# Altium project Wildcat Racing.PrjPcb
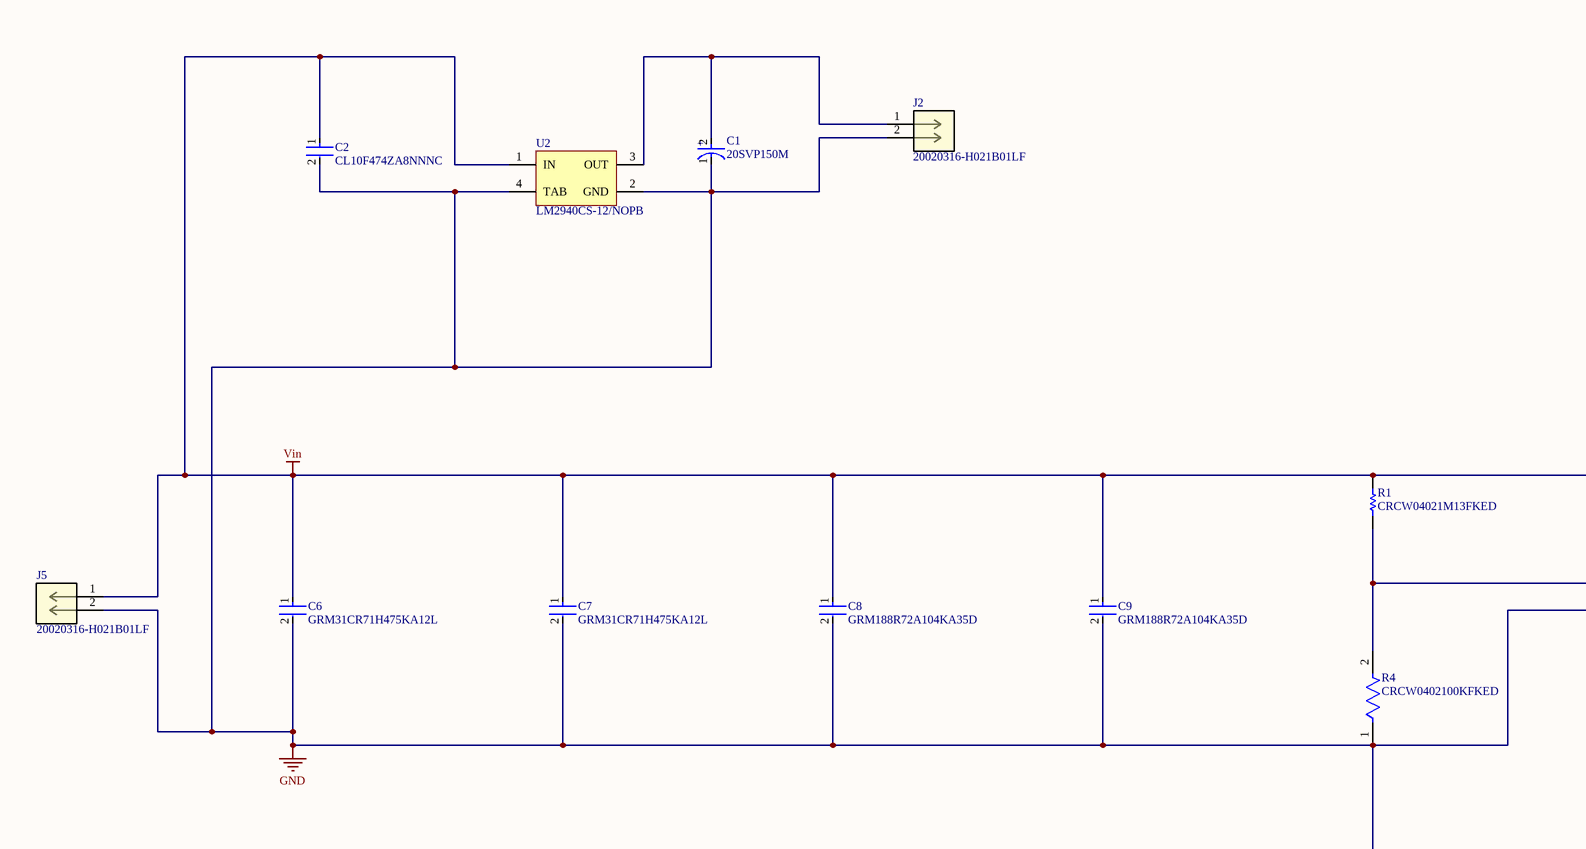
[diagram p0: 12V Power.SchDoc, left]
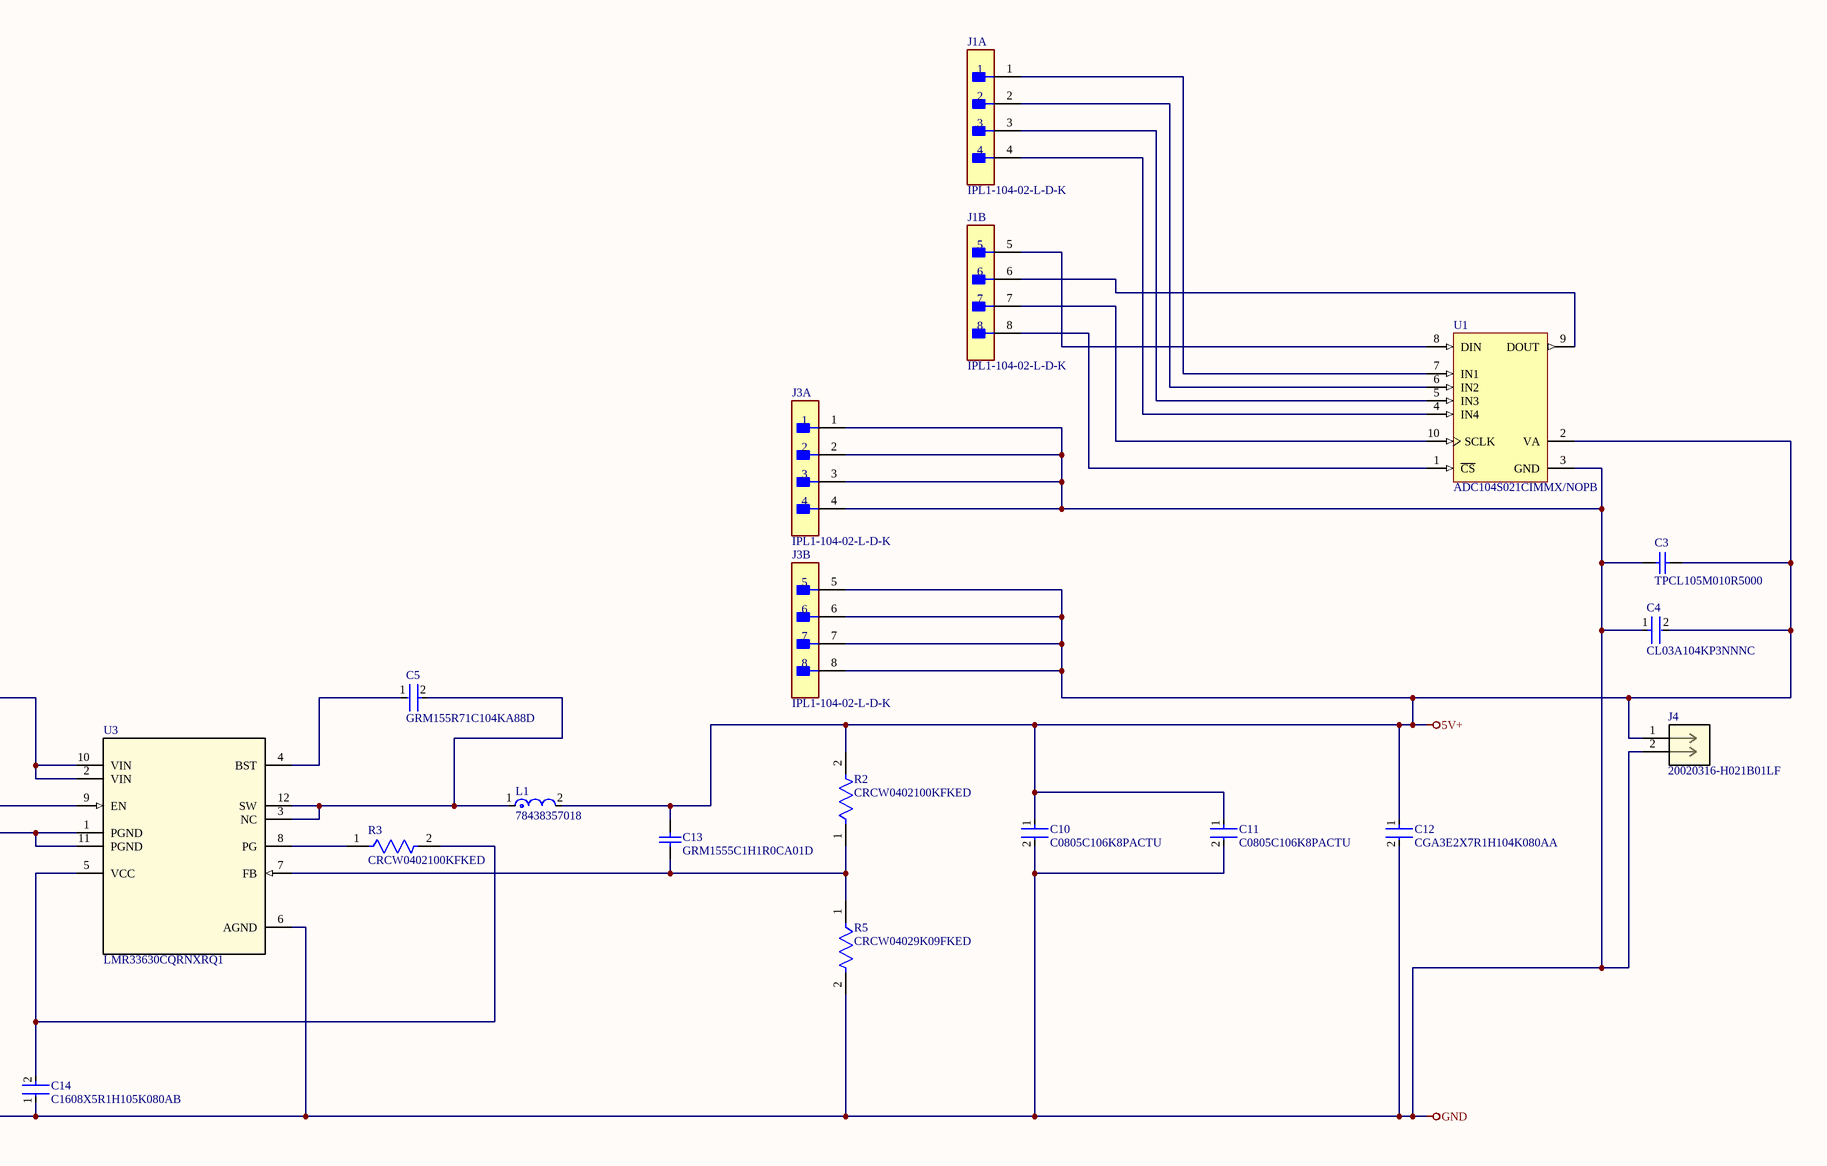
[diagram p1: 12V Power.SchDoc, right]
1 sheet, 28 parts. Net scope: global (net labels, ports and power ports of the same name join across sheets).
Board file: 12V Power.PcbDoc

## Sheet 12V Power.SchDoc
size D; SheetNumber: 1; SheetTotal: 1

### Parts
C1  20SVP150M  [FP-OS-CON-SMT-F12-MFG]
C2  CL10F474ZA8NNNC  [FP-CL10-IPC_C]
C3  TPCL105M010R5000  [CAPC1609X100X15LL20]
C4  CL03A104KP3NNNC  [FP-CL03-IPC_C]
C5  GRM155R71C104KA88D  [FP-GRM15-MFG]
C6  GRM31CR71H475KA12L  [FP-GRM31C-0_2-e0_3_0_8-IPC_C]
C7  GRM31CR71H475KA12L  [FP-GRM31C-0_2-e0_3_0_8-IPC_C]
C8  GRM188R72A104KA35D  [FP-GRM188-0_1-e0_2_0_5-IPC_B]
C9  GRM188R72A104KA35D  [FP-GRM188-0_1-e0_2_0_5-IPC_B]
C10  C0805C106K8PACTU  [FP-C0805C-DG-MFG]
C11  C0805C106K8PACTU  [FP-C0805C-DG-MFG]
C12  CGA3E2X7R1H104K080AA  [FP-CGA3E-0_3-0_1-IPC_A]
C13  GRM1555C1H1R0CA01D  [CAPC1005X55X25NL05T10]
C14  C1608X5R1H105K080AB  [FP-C1608-080-0_1-IPC_B]
J1  IPL1-104-02-L-D-K  [FP-IPL1-104-02-L-D-K-0]  (parts A,B of 2)
J2  20020316-H021B01LF  [CONN_20020316-H021B01LF_AMP]
J3  IPL1-104-02-L-D-K  [FP-IPL1-104-02-L-D-K-0]  (parts A,B of 2)
J4  20020316-H021B01LF  [CONN_20020316-H021B01LF_AMP]
J5  20020316-H021B01LF  [CONN_20020316-H021B01LF_AMP]
L1  78438357018  [FP-78438357018-MFG]
R1  CRCW04021M13FKED  [RESC1005X40X25ML05T05]
R2  CRCW0402100KFKED  [FP-CRCW0402-e3-IPC_C]
R3  CRCW0402100KFKED  [FP-CRCW0402-e3-IPC_C]
R4  CRCW0402100KFKED  [FP-CRCW0402-e3-IPC_C]
R5  CRCW04029K09FKED  [FP-CRCW0402-e3-IPC_A]
U1  ADC104S021CIMMX/NOPB  [MUB10A_N]
U2  LM2940CS-12/NOPB  [KTT0003B_N]
U3  LMR33630CQRNXRQ1  [RNX0012B]

### Nets
5V+: C3.1 C4.2 C10.1 C11.1 C12.1 C13.2 J3.5 J3.6 J3.7 J3.8 J4.1 L1.2 R2.2 U1.2(VA)
GND: C1.1(C) C2.2 C3.2 C4.1 C6.2 C7.2 C8.2 C9.2 C10.2 C11.2 C12.2 C14.1 J2.2 J3.1 J3.2 J3.3 J3.4 J4.2 J5.2 R4.1 R5.2 U1.3(GND) U2.2(GND) U2.4(TAB) U3.1(PGND) U3.6(AGND) U3.11(PGND)
Vin: C2.1 C6.1 C7.1 C8.1 C9.1 J5.1 R1.2 U2.1(IN) U3.2(VIN) U3.10(VIN)
NetC1_2: C1.2(A) J2.1 U2.3(OUT)
NetC5_1: C5.1 U3.4(BST)
NetC5_2: C5.2 L1.1 U3.3(NC) U3.12(SW)
NetC13_1: C13.1 R2.1 R5.1 U3.7(FB)
NetC14_2: C14.2 R3.2 U3.5(VCC)
NetJ1_1: J1.1 U1.7(IN1)
NetJ1_2: J1.2 U1.6(IN2)
NetJ1_3: J1.3 U1.5(IN3)
NetJ1_4: J1.4 U1.4(IN4)
NetJ1_5: J1.5 U1.8(DIN)
NetJ1_6: J1.6 U1.9(DOUT)
NetJ1_7: J1.7 U1.10(SCLK)
NetJ1_8: J1.8 U1.1(~{CS})
NetR1_1: R1.1 R4.2 U3.9(EN)
NetR3_1: R3.1 U3.8(PG)

### Notes on the sheet
- (in symbol CMP-05428-000386-1) +

### Library data of the parts
C1 = CMP-05428-000386-1: Conductive Polymer Aluminum Solid Capacitors (OS-CON) 150uF ±20% 20V RADIAL SMT 10x12.6mm; ESR (Equivalent Series Resistance): 20mR; Ripple Current (AC): 4.32A; Polarity: Polar; Life (Hours): 2000Hour; Leakage Current: 600uA; Dissipation Factor: 15%; Package Quantity: 400; Series: OS-CON™, SVP; Min Operating Temperature: -55°C; Mount: Surface Mount; Tolerance: 20%; Voltage Rating: 20V; Packaging: Tape and Reel; RoHS Compliant: Yes; Number of Pins: 12; Voltage: 20V; REACH SVHC: No SVHC; Diameter: 10mm; Construction: Cylindrical; Height: 12.6mm; Case/Package: Radial; Capacitance: 150uF; Length: 12.6mm; Height - Seated (Max): 0.5inch; Termination: SMD/SMT; Ripple Current: 4.32A; Lead Free: Lead Free; Voltage Rating (DC): 20V; Max Operating Temperature: 105°C; Radiation Hardening: No
C2 = CMP-13271-004088-1: Cap Ceramic 470nF 25V Y5V -20/+80% Pad SMD 0603 +85°C T/R; Tolerance: 80%; Packaging: Tape and Reel; Mount: Surface Mount; Height: 0.8mm; Voltage Rating: 25V; Width: 0.031inch; Lead Free: Lead Free; Dielectric: Y5V; Min Operating Temperature: -30°C; Package Quantity: 1; Thickness: 0.035inch; Case Code (Imperial): 0603; Radiation Hardening: No; Case/Package: 0603; Case Code (Metric): 1608; Length: 1.6mm; Depth: 0.8mm; Voltage Rating (DC): 25V; Capacitance: 470nF; Max Operating Temperature: 85°C
C3 = CMP-2006-00208-1: Manufacturer: AVX Interconnect / Elco; Part Number: TPCL105M010R5000
C4 = CMP-2010-00672-2: Cap Ceramic 100nF 10V X5R ±10% Pad SMD 0201 +85°C T/R; Radiation Hardening: No; Voltage Rating: 10V; Dielectric: X5R; Length: 0.6mm; Voltage Rating (DC): 10V; Package Quantity: 1; Height: 0.3mm; Width: 0.012inch; Min Operating Temperature: -55°C; Lead Free: Lead Free; Tolerance: 10%; Contact Plating: Tin; Depth: 0.3mm; Max Operating Temperature: 85°C; Case/Package: 0201; Capacitance: 100nF; Mount: Surface Mount; Thickness: 0.013inch; Case Code (Metric): 0603; Case Code (Imperial): 0201; Packaging: Tape and Reel
C5 = CMP-2100-03641-2: CAP CER 0.1UF 16V X7R 0402; Manufacturer: Murata; Standoff Height: 0mm; Tolerance: 10%; Description: CAP Ceramic 0.10μF 10% X7R 16Vdc 0402 SMD; Voltage Rating: 16Vdc; Material: Ceramic; Capacitance: 0.10μF; Value: 0.10μF; RoHS: TRUE; Manufacturer Part Number: GRM155R71C104KA88D; Temperature Characteristic: X7R; Octopart: https://octopart.com/grm155r71c104ka88d-murata-196880; Digikey Description: CAP CER 0.1UF 16V X7R 0402; Device Class L3: Ceramic Capacitors; Height: 0.55mm; ComponentLink2Description: Datasheet; Temperature Range Low: -55°C; Ipc Land Pattern Name: CAPC10050X219; ComponentLink2URL: https://search.murata.co.jp/Ceramy/image/img/A01X/G101/ENG/GRM155R71H471KA01-01A.pdf; Device Class L1: Passive Components; Lead Free: yes; Category: Cap; Package: GRM15; Temperature: -55°C to +125°C; Device Class L2: Capacitors; Temperature Range High: +125°C; Mouser Description: 0402 0.1 uF 16V ±10 % Tolerance X7R SMT Multilayer Ceramic Capacitor
C6 C7 = CMP-1037-04923-3: Chip Multilayer Ceramic Capacitors for General Purpose, 1206, 4.7uF, X7R, 15%, 10%, 50V; Height: 1.6mm; Voltage: 50V; Capacitance: 4.7uF; Lead Free: Lead Free; Max Operating Temperature: 125°C; Packaging: Tape and Reel; REACH SVHC: No SVHC; Voltage Rating: 50V; Mount: Surface Mount; Termination: SMD/SMT; Tolerance: 10%; Case/Package: 1206; Material: Ceramic; Depth: 1.6mm; Length: 3.2mm; Case Code (Metric): 3216; Voltage Rating (DC): 50V; Case Code (Imperial): 1206; Radiation Hardening: No; Width: 0.063inch; Thickness: 0.071inch; Package Quantity: 2000; Min Operating Temperature: -55°C; Dielectric: X7R
C8 C9 = CMP-1035-02595-8: Chip Multilayer Ceramic Capacitors for General Purpose, 0603, 0.10uF, X7R, 15%, 10%, 100V; Capacitance: 100nF; Voltage Rating (DC): 100V; Material: Ceramic; Packaging: Tape and Reel; Dielectric: X7R; Case Code (Imperial): 0603; Package Quantity: 1; Height: 0.8mm; Weight: 0.000222oz; Min Operating Temperature: -55°C; Depth: 0.8mm; Mount: Surface Mount; Thickness: 0.035inch; Voltage: 100V; REACH SVHC: No SVHC; Case/Package: 0603; Voltage Rating: 100V; Width: 0.8mm; Tolerance: 10%; Lead Free: Lead Free; Case Code (Metric): 1608; Radiation Hardening: No; Max Operating Temperature: 125°C; Termination: SMD/SMT; Length: 1.6mm
C10 C11 = CMP-2007-03243-2: CAP CER 10UF 10V X5R 0805; Manufacturer: Kemet; 3DS Part Number: 220-00001; Tolerance: 10%; Temperature Coefficient: 15%; Material: Ceramic; Device Class L2: Capacitors; Device Class L1: Passive Components; ComponentLink2URL: https://content.kemet.com/datasheets/KEM_C1006_X5R_SMD.pdf; Height: 1.4mm; Lead Free: Yes; Manufacturer Part Number: C0805C106K8PACTU; Digikey Description: CAP CER 10UF 10V X5R 0805; Octopart: https://octopart.com/c0805c106k8pactu-kemet-98697; Capacitance: 10uF; Value: 10uF; Temperature Range Low: -55°C; Temperature: -55°C to +85°C; Automotive: No; Mouser Description: CAP CER 10UF 10V X5R 0805; Ipc Land Pattern Name: CAPC200125X125; Temperature Range High: +85°C; Voltage: 10V; RoHS: TRUE; Device Class L3: Ceramic Capacitors; ComponentLink2Description: Datasheet; Voltage Rating: 10V; Package: C0805C-DG; Temperature Characteristic: X5R; Category: Cap
C12 = CMP-2000-07546-2: Cap Ceramic 100nF 50V X7R 10% Pad SMD 0603 +125°C Automotive T/R; Weight: 7.1E-05oz; Composition: Ceramic; Max Operating Temperature: 125°C; Termination: SMD/SMT; Dielectric: X7R; Length: 1.6mm; Package Quantity: 1; REACH SVHC: No SVHC; Lead Free: Lead Free; Case Code (Metric): 1608; Min Operating Temperature: -55°C; Packaging: Tape and Reel; Tolerance: 10%; Voltage Rating: 50V; Case Code (Imperial): 0603; Capacitance: 100nF; Case/Package: 0603; Voltage Rating (DC): 50V; Depth: 0.8mm; Radiation Hardening: No; Ratings: AEC-Q200; Mount: Surface Mount; Voltage: 50V; Thickness: 0.035inch; Width: 0.8mm; Height: 0.8mm
C13 = CMP-2008-04277-1: Manufacturer: Murata; Part Number: GRM1555C1H1R0CA01D
C14 = CMP-2000-06025-2: Multilayer Ceramic Capacitors 1μF ±10% 50V X5R SMD 0603; Capacitance: 1uF; Lead Free: Lead Free; Height: 0.8mm; Mount: Surface Mount; Radiation Hardening: No; Thickness: 0.035inch; Length: 1.6mm; Max Operating Temperature: 85°C; REACH SVHC: No SVHC; Min Operating Temperature: -55°C; Construction: Flat; RoHS Compliant: Yes; Voltage Rating: 50V; Dielectric: X5R; Packaging: Tape and Reel; Termination: SMD/SMT; Voltage Rating (DC): 50V; Case Code (Imperial): 0603; Voltage: 50V; Width: 0.031inch; Weight: 7.1E-05oz; Depth: 0.8mm; Case Code (Metric): 1608; Series: C; Case/Package: 0603; Tolerance: 10%; Resistor Type: Ceramic; Number of Pins: 2; Dielectric Material: Ceramic; Package Quantity: 1
J1 J3 = CMP-02766-000804-1: 4 Position 2 Row .100" (2.54 mm) pitch connector; Number of Contacts: 8; Pitch: 2.54mm; Max Voltage Rating (AC): 675V; Max Current Rating: 7.4A; Gender: Male; Number of Ports: 1; Min Operating Temperature: -55°C; Length: 11.68mm; Mount: Surface Mount; Housing Material: Polymer; Orientation: Straight; Packaging: Rail/Tube; Max Operating Temperature: 125°C; Contact Plating: Gold; Radiation Hardening: No; Termination: Solder; Contact Material: Bronze; Number of Terminals/Pins: 8; Depth: 9.58mm
J2 J4 J5 = 20020316-H021B01LF: No Description Available; Mfr_Name: Amphenol ICC; Copyright: Copyright (C) 2022 Ultra Librarian. All rights reserved.; Manufacturer_Part_Number: 20020316-H021B01LF; RefDes: RefDes; Type: DEV
L1 = CMP-207846-000027-1: FIXED IND 1.8UH 5.8A 21MOHM SMD; Saturation Current: 8A; Tolerance: 20%; Test Frequency: 100kHz; Shielding: Shielded; Self Resonant Frequency: 42MHz; DC Resistance (DCR): 21mR; Core Material: Ferrite; Max Operating Temperature: 125°C; Ratings: AEC-Q200; RoHS Compliant: Yes; Packaging: Tape and Reel; Inductance: 1.8uH; Current Rating: 5.8A; Resistor Type: Wirewound; Case/Package: Nonstandard; Mount: Surface Mount; Min Operating Temperature: -40°C
R1 = CMP-1011-00854-2: Manufacturer: Vishay Dale; Part Number: CRCW04021M13FKED
R2-R4 = CMP-2002-08123-3: RES Thick Film, 100kΩ, 1%, 0.063W, 100ppm/°C, 0402; Power Rating: 63mW; Resistance: 100kR; Voltage Rating (DC): 50V; Lead Free: Lead Free; Height: 0.35mm; Contact Plating: Tin; Min Operating Temperature: -55°C; Package Quantity: 10000; Case/Package: 0402; Temperature Coefficient: 100ppm/°C; Number of Terminations: 2; Packaging: Tape and Reel; Max Power Dissipation: 63mW; Case Code (Metric): 1005; Mount: Surface Mount; Width: 0.02inch; Termination: SMD/SMT; Length: 1mm; Number of Pins: 2; Weight: 2.3E-05oz; Radiation Hardening: No; Tolerance: 1%; Military Standard: Not; Features: Automotive AEC-Q200; Depth: 0.5mm; Composition: Thick Film; Max Operating Temperature: 155°C; Voltage Rating: 50V; Case Code (Imperial): 0402
R5 = CMP-2002-00285-2: RES Thick Film, 9.09kΩ, 1%, 0.063W, 100ppm/°C, 0402; Voltage Rating (DC): 50V; Resistance: 9.09kR; Max Power Dissipation: 63mW; Radiation Hardening: No; Number of Pins: 2; Lead Free: Lead Free; Weight: 2.3E-05oz; Contact Plating: Tin; Tolerance: 1%; Depth: 0.5mm; Mount: Surface Mount; Composition: Thick Film; Voltage Rating: 50V; Features: Automotive AEC-Q200; Packaging: Tape and Reel; Power Rating: 63mW; Height: 0.35mm; Min Operating Temperature: -55°C; Number of Terminations: 2; Package Quantity: 10; Case Code (Imperial): 0402; Temperature Coefficient: 100ppm/°C; Case/Package: 0402; Max Operating Temperature: 155°C; Military Standard: Not; Termination: SMD/SMT; Case Code (Metric): 1005; Width: 0.02inch; Length: 1mm
U1 = CMP-0054-00490-2: 4 Channel, 50 kSPS to 200 kSPS, 10-Bit A/D Converter, 10-pin Mini SOIC, Pb-Free; Manufacturer: National Semiconductor; PackageTopMarking: ZXTT*X20C; PowerWise: Y; CompType: ADC IC; RoHS: Y; DatasheetVersion: Feb-2010; PackageReference: MUB10A; ComponentLink3Description: MUB10A Package Page; ComponentLink1Description: ADC104S021 Datasheet; ComponentLink1URL: http://www.national.com/ds/AD/ADC104S021.pdf; ComponentLink2Description: ADC104S021 Web Page; PinCount: 10; Code_JEDEC: MO-187-BA; PackageDescription: Mini-SO, Molded, .118 x .118 x .034in Body, 10 Lead, .0197in Pitch; ComponentLink2URL: http://www.national.com/pf/AD/ADC104S021.html; PackageVersion: revB, Jul-2003; RevisionNote: Component URLs added; ComponentLink3URL: http://www.national.com/packaging/folders/mub10a.html
U2 = CMP-0062-00534-4: 1A Low Dropout Regulator, 3-pin TO-263, Pb-Free; Manufacturer: Texas Instruments; PowerWise: N; CompType: LDO IC; PackageTopMarking: NSUZXYTTE#*LM2940CS*-12 P+; PackageDescription: TO-263, Molded, .400 x .390 x .180in, 3 Lead, .1in Pitch, Surface Mount; Code_JEDEC: MO-169-AA; RoHS: Y; PackageReference: KTT0003B; ComponentLink1Description: Datasheet URL; ComponentLink1URL: http://www.ti.com/general/docs/lit/getliterature.tsp?genericPartNumber=LM2940C&fileType=pdf; PinCount: 3
U3 = LMR33630CQRNXRQ1_1: No Description Available; Mfr_Name: Texas Instruments; Type: DEV; RefDes: RefDes; Copyright: Copyright (C) 2022 Ultra Librarian. All rights reserved.; Manufacturer_Part_Number: LMR33630CQRNXRQ1